# Altium schematic sheet ARM_Motor.SchDoc: Title
size A4; Date: *******; ApprovedBy: *******; CheckedBy: None; Author: *******; CompanyName: *******; DrawnBy: Jacob Chisholm; Engineer: *******; Organization: *******; Address1: *******; Address2: *******; Address3: *******; Address4: *******; DocumentNumber: 4; Revision: *******; SheetNumber: 4; SheetTotal: 9; Address_Website: https://jchisholm204.github.io; E-Mail: JacobChisholm1010@gmail.com; CurrentTime: *******; CurrentDate: *******; Time: *******; DocumentFullPathAndName: *******; DocumentName: *******; ModifiedDate: *******; ImagePath: *******; ProjectName: *******; Application_BuildNumber: *******
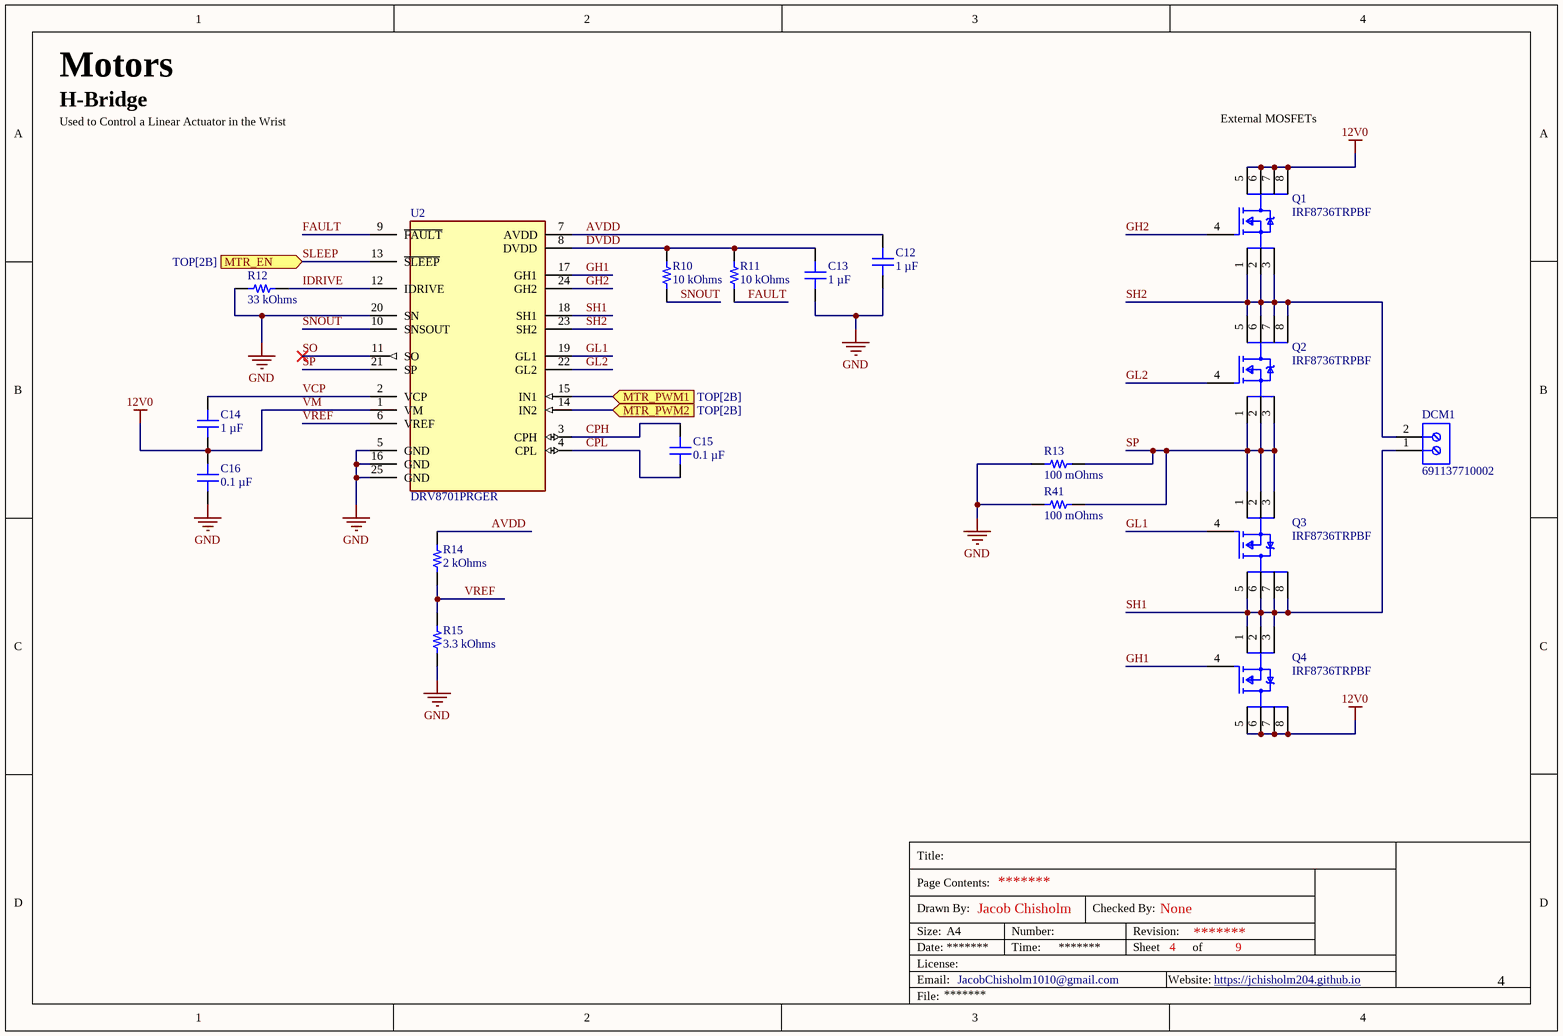
[diagram p0: ARM_Motor.SchDoc]

## Parts
C12  1 µF  [CAP 0603_1608]
C13  1 µF  [CAP 0603_1608]
C14  1 µF  [CAP 0603_1608]
C15  0.1 µF  [CAP 0603_1608]
C16  0.1 µF  [CAP 0603_1608]
DCM1  691137710002  [691137710002]
Q1  IRF8736TRPBF  [FP-PG-DSO-8-MFG]
Q2  IRF8736TRPBF  [FP-PG-DSO-8-MFG]
Q3  IRF8736TRPBF  [FP-PG-DSO-8-MFG]
Q4  IRF8736TRPBF  [FP-PG-DSO-8-MFG]
R10  10 kOhms  [RES 0603_1608]
R11  10 kOhms  [RES 0603_1608]
R12  33 kOhms  [RES 0603_1608]
R13  100 mOhms  [RES 2512_6432]
R14  2 kOhms  [RES 0603_1608]
R15  3.3 kOhms  [RES 0603_1608]
R41  100 mOhms  [RES 2512_6432]
U2  DRV8701PRGER  [FP-RGE0024F-MFG]

## Ports
MTR_EN (in, see TOP[2B]), MTR_PWM1 (in, see TOP[2B]), MTR_PWM2 (in, see TOP[2B])

## Nets
GND: C12.1 C13.1 C16.1 R12.2 R13.1 R15.1 R41.1 U2.5(GND) U2.16(GND) U2.20(SN) U2.25(GND)
VM: C14.1 C16.2 Q1.5(D) Q1.6(D) Q1.7(D) Q1.8(D) Q4.5(D) Q4.6(D) Q4.7(D) Q4.8(D) U2.1(VM)  [also labelled 12V0]
AVDD: C12.2 R14.2 U2.7(AVDD)
CPH: C15.2 U2.3(CPH)
CPL: C15.1 U2.4(CPL)
DVDD: C13.2 R10.2 R11.2 U2.8(DVDD)
FAULT: R11.1 U2.9(~{FAULT})
GH1: Q4.4(G) U2.17(GH1)
GH2: Q1.4(G) U2.24(GH2)
GL1: Q3.4(G) U2.19(GL1)
GL2: Q2.4(G) U2.22(GL2)
IDRIVE: R12.1 U2.12(IDRIVE)
MTR_PWM1: U2.15(IN1) ; port MTR_PWM1
MTR_PWM2: U2.14(IN2) ; port MTR_PWM2
SH1: DCM1.1 Q3.5(D) Q3.6(D) Q3.7(D) Q3.8(D) Q4.1(S) Q4.2(S) Q4.3(S) U2.18(SH1)
SH2: DCM1.2 Q1.1(S) Q1.2(S) Q1.3(S) Q2.5(D) Q2.6(D) Q2.7(D) Q2.8(D) U2.23(SH2)
SLEEP: U2.13(~{SLEEP}) ; port MTR_EN
SNOUT: R10.1 U2.10(SNSOUT)
SO: U2.11(SO)
SP: Q2.1(S) Q2.2(S) Q2.3(S) Q3.1(S) Q3.2(S) Q3.3(S) R13.2 R41.2 U2.21(SP)
VCP: C14.2 U2.2(VCP)
VREF: R14.1 R15.2 U2.6(VREF)

## Notes on the sheet
- Motors
- H-Bridge
- Used to Control a Linear Actuator in the Wrist
- External MOSFETs
- 4
- Title:
- Drawn By:
- Page Contents:
- Checked By:
- Size:
- Date:
- File:
- License:
- Email:
- A4
- Number:
- Time:
- Revision:
- Sheet
- Website:
- of

## Library data of the parts
C12-C14 = GMC10X7R105K50NT: CAP0603 X7R 1UF 10% 50V; manufacturer: Cal-Chip Electronics, Inc.; Part Number: GMC10X7R105K50NT; Value: 1 µF; Applications: General Purpose; Capacitance: 1 µF; componentlink1description: Datasheet; componentlink1url: https://88ce57.p3cdn1.secureserver.net/wp-content/uploads/2023/01/gmc_series-2.pdf; componentlink2description: DigiKey Link; componentlink2url: https://www.digikey.com/en/products/detail/cal-chip-electronics-inc/GMC10X7R105K50NT/18151141; Device Package: 0603 (1608 Metric); lastupdated: 2/9/2024 8:09:39 PM; Lifecycle Status: Active; Minimum Order: 1; Mounting Type: Surface Mount, MLCC; Operating Temperature: -55°C ~ 125°C; Package / Case: 0603 (1608 Metric); packaging: TapeAndReel; partid: 49828; Part Status: Active; price: 0.03; series: GMC; Size / Dimension: 0.063" L x 0.031" W (1.60mm x 0.80mm); Supplier 1: DigiKey; Supplier Part Number 1: 4713-GMC10X7R105K50NTCT-ND; Temperature Coefficient: X7R; Thickness (Max): 0.037" (0.95mm); Tolerance: ±10%; Voltage - Rated: 50V
C15 C16 = GMC10X7R104K25NT: CAP0603 X7R .1UF 10% 25V; manufacturer: Cal-Chip Electronics, Inc.; Part Number: GMC10X7R104K25NT; Value: 0.1 µF; Applications: General Purpose; Capacitance: 0.1 µF; componentlink1description: Datasheet; componentlink1url: https://88ce57.p3cdn1.secureserver.net/wp-content/uploads/2023/01/gmc_series-2.pdf; componentlink2description: DigiKey Link; componentlink2url: https://www.digikey.com/en/products/detail/cal-chip-electronics-inc/GMC10X7R104K25NT/19910724; Device Package: 0603 (1608 Metric); lastupdated: 2/9/2024 8:08:39 PM; Lifecycle Status: Active; Minimum Order: 1; Mounting Type: Surface Mount, MLCC; Operating Temperature: -55°C ~ 125°C; Package / Case: 0603 (1608 Metric); packaging: TapeAndReel; partid: 56631; price: 0.01; series: GMC; Size / Dimension: 0.063" L x 0.031" W (1.60mm x 0.80mm); Supplier 1: DigiKey; Supplier Part Number 1: 4713-GMC10X7R104K25NTCT-ND; Temperature Coefficient: X7R; Thickness (Max): 0.035" (0.90mm); Tolerance: ±10%; Voltage - Rated: 25V
DCM1 = CMP-1502-03324-2: NexarPartId: 78871135; Voltage Rating: 300V; Number of Contacts: 2; Current Rating: 16A; Lead Pitch: 5mm; Height: 11.6mm; Packaging: Box; RoHS: Non-Compliant; Contact Material: Nickel, Tin; Max Operating Temperature: 120°C; Number of Pins: 2; Min Operating Temperature: -30°C; Number of Rows: 1
Q1-Q4 = CMP-32901-000123-1: MOSFET N-CH 30V 18A 8-SOIC; Manufacturer: Infineon; Depletion Mode: False; Max Junction Temp: +150°C; Reverse Recovery Charge: 19nC; Power Dissipation: 2.5W; Threshold Vgs Max: 2.35V; Number Of Channels: 1; Standoff Height: 0.1mm; Reverse Recovery Time: 16ns; Turn On Delay Time: 12ns; Gate To Source Voltage: 20V; Turn Off Delay Time: 13ns; Input Capacitace At Vds: 2315pF @ 15V; Gate Charge At Vgs: 17nC @ 4.5V; Rthja Max: 50°C/W; Description: N-Channel 30V 18A (Ta) 2.5W (Ta) Surface Mount 8-SO; Max Forward Diode Voltage: 1V; Drain To Source Resistance: 5.5mΩ; Pulse Drain Current: 144A; Threshold Vgs Min: 1.35V; Digikey Description: MOSFET N-CH 30V 18A 8-SOIC; Temperature Range Low: -55°C; Ipc Land Pattern Name: SOIC127P600X155-8; Octopart: https://octopart.com/irf8736trpbf-infineon-65873731; Device Class L2: Transistors; Drain To Source Voltage: 30V; Drain To Source Breakdown Voltage: 30V; Device Class L3: MOSFETs; Category: Trans; Footprint Url: https://www.infineon.com/dgdl/po-so8.pdf?fileId=5546d462580663ef0158068a1275014d; Package: PG-DSO-8; Device Class L1: Discrete Semiconductors; Automotive: No; Manufacturer Part Number: IRF8736TRPBF; Temperature: -55°C to +150°C; Height: 1.75mm; RoHS: TRUE; ComponentLink2URL: https://www.infineon.com/dgdl/irf8736pbf.pdf?fileId=5546d462533600a40153560d9e661d7f; Number Of N Channels: 1; ComponentLink2Description: Datasheet; Continuous Drain Current: 18A; Lead Free: Yes; Temperature Range High: +150°C
R10 R11 = RNCF0603TKW10K0: RES 10K OHM 0.01% 1/10W 0603; Manufacturer: Stackpole Electronics Inc; Power (Watts): 0.1W, 1/10W; Temperature Coefficient: ±2ppm/°C; Part Number: RNCF0603TKW10K0; Value: 10 kOhms; ComponentLink1Description: Datasheet; ComponentLink1URL: https://www.seielect.com/catalog/sei-rncf.pdf; ComponentLink2Description: DigiKey Link; ComponentLink2URL: https://www.digikey.com/en/products/detail/stackpole-electronics-inc/RNCF0603TKW10K0/10290270; Composition: Thin Film; Device Package: 0603 (1608 Metric); Features: Automotive AEC-Q200; Height - Seated (Max): 0.022" (0.55mm); LastUpdated: 2/9/2024 8:43:10 PM; Lifecycle Status: Active; Minimum Order: 1; Number of Terminations: 2; Operating Temperature: -55°C ~ 155°C; Package / Case: 0603 (1608 Metric); Packaging: TapeAndReel; PartId: 11561; Part Status: Active; Price: 1.24; Ratings: AEC-Q200; Resistance: 10 kOhms; Series: RNCF; Size / Dimension: 0.061" L x 0.031" W (1.55mm x 0.80mm); Supplier 1: DigiKey; Supplier Part Number 1: RNCF0603TKW10K0CT-ND; Supplier Device Package: 0603; Tolerance: ±0.01%
R12 = ERJ-H3ED3302V: RES 33K OHM 0.5% 1/8W 0603; Manufacturer: Panasonic Electronic Components; Power (Watts): 0.125W, 1/8W; Temperature Coefficient: ±100ppm/°C; Part Number: ERJ-H3ED3302V; Value: 33 kOhms; ComponentLink1Description: Datasheet; ComponentLink1URL: https://b2b-api.panasonic.eu/file_stream/pids/fileversion/236250; ComponentLink2Description: DigiKey Link; ComponentLink2URL: https://www.digikey.com/en/products/detail/panasonic-electronic-components/ERJ-H3ED3302V/13877675; Composition: Thick Film; Device Package: 0603 (1608 Metric); Features: Automotive AEC-Q200; Height - Seated (Max): 0.022" (0.55mm); LastUpdated: 2/9/2024 8:41:37 PM; Lifecycle Status: Active; Minimum Order: 1; Number of Terminations: 2; Operating Temperature: -55°C ~ 175°C; Package / Case: 0603 (1608 Metric); Packaging: TapeAndReel; PartId: 63754; Part Status: Active; Price: 0.03; Ratings: AEC-Q200; Resistance: 33 kOhms; Series: ERJ-H3E; Size / Dimension: 0.063" L x 0.031" W (1.60mm x 0.80mm); Supplier 1: DigiKey; Supplier Part Number 1: 10-ERJ-H3ED3302VCT-ND; Supplier Device Package: 0603; Tolerance: ±0.5%
R13 R41 = CSR2512C0R1F: RES 0.1 OHM 1% 3W 2512; manufacturer: Riedon; Temperature Coefficient: ±50ppm/°C; Part Number: CSR2512C0R1F; componentlink1description: Datasheet; componentlink1url: https://riedon.com/media/pdf/CSR.pdf; componentlink2description: DigiKey Link; componentlink2url: http://digikey.com/product-detail/en/riedon/CSR2512C0R1F/696-1680-1-ND/5723668; Composition: Metal Element; Device Package: 2512 (6432 Metric); Features: Current Sense, Non-Inductive; Height - Seated (Max): 0.035" (0.90mm); lastupdated: 6/3/2024 8:19:22 PM; Lifecycle Status: Active; Minimum Order: 1; Number of Terminations: 2; Operating Temperature: -55°C ~ 170°C; Package / Case: 2512 (6432 Metric); packaging: TapeAndReel; Part Status: Active; Power (Watts): 3W; price: 0.18; Resistance: 100 mOhms; series: CSR; Size / Dimension: 0.250" L x 0.118" W (6.35mm x 3.00mm); Supplier 1: DigiKey; Supplier Part Number 1: 696-1680-1-ND; Supplier Device Package: 2512; Tolerance: ±1%; value: 100 mOhms
R14 = PTN0603Y2001BST1: PTN0603 10PPM 2K 0.1% S T1 E1; Manufacturer: Vishay Dale Thin Film; Power (Watts): 0.15W; Temperature Coefficient: ±10ppm/°C; Part Number: PTN0603Y2001BST1; Value: 2 kOhms; ComponentLink1Description: Datasheet; ComponentLink1URL: https://www.vishay.com/docs/60026/ptn.pdf; ComponentLink2Description: DigiKey Link; ComponentLink2URL: https://www.digikey.com/en/products/detail/vishay-dale-thin-film/PTN0603Y2001BST1/12820639; Composition: Thin Film; Device Package: 0603 (1608 Metric); Features: Anti-Sulfur, Moisture Resistant, Non-Inductive; Height - Seated (Max): 0.020" (0.51mm); LastUpdated: 2/9/2024 8:40:46 PM; Lifecycle Status: Active; Minimum Order: 1; Number of Terminations: 2; Operating Temperature: -55°C ~ 155°C; Package / Case: 0603 (1608 Metric); Packaging: TapeAndReel; PartId: 75287; Part Status: Active; Price: 0.26; Resistance: 2 kOhms; Series: PTN; Size / Dimension: 0.064" L x 0.032" W (1.63mm x 0.81mm); Supplier 1: DigiKey; Supplier Part Number 1: 764-PTN0603Y2001BST1CT-ND; Supplier Device Package: 0603; Tolerance: ±0.1%
R15 = ERA-3VRW3301V: RES 3.3K OHM 0.05% 1/8W 0603; Manufacturer: Panasonic Electronic Components; Power (Watts): 0.125W, 1/8W; Temperature Coefficient: ±10ppm/°C; Part Number: ERA-3VRW3301V; Value: 3.3 kOhms; ComponentLink1Description: Datasheet; ComponentLink1URL: https://api.pim.na.industrial.panasonic.com/file_stream/main/fileversion/9152; ComponentLink2Description: DigiKey Link; ComponentLink2URL: https://www.digikey.com/en/products/detail/panasonic-electronic-components/ERA-3VRW3301V/12086165; Composition: Thin Film; Device Package: 0603 (1608 Metric); Features: Anti-Sulfur, Automotive AEC-Q200; Height - Seated (Max): 0.022" (0.55mm); LastUpdated: 2/9/2024 8:41:00 PM; Lifecycle Status: Active; Minimum Order: 1; Number of Terminations: 2; Operating Temperature: -55°C ~ 155°C; Package / Case: 0603 (1608 Metric); Packaging: TapeAndReel; PartId: 71786; Part Status: Active; Price: 0.19; Ratings: AEC-Q200; Resistance: 3.3 kOhms; Series: ERA-3V; Size / Dimension: 0.063" L x 0.031" W (1.60mm x 0.80mm); Supplier 1: DigiKey; Supplier Part Number 1: 10-ERA-3VRW3301VCT-ND; Supplier Device Package: 0603; Tolerance: ±0.05%
U2 = CMP-04915-000037-1: IC MOTOR DRIVER 0V-5.5V 24VQFN; Interface: PWM; Case/Package: VQFN; Packaging: Tape and Reel; Mount: Surface Mount; Max Operating Temperature: 125°C; RoHS Compliant: Yes; Lead Free: Lead Free; Min Operating Temperature: -40°C